# Altium schematic sheet 1_Sheet_1.schdoc
size 373 x 218 mm
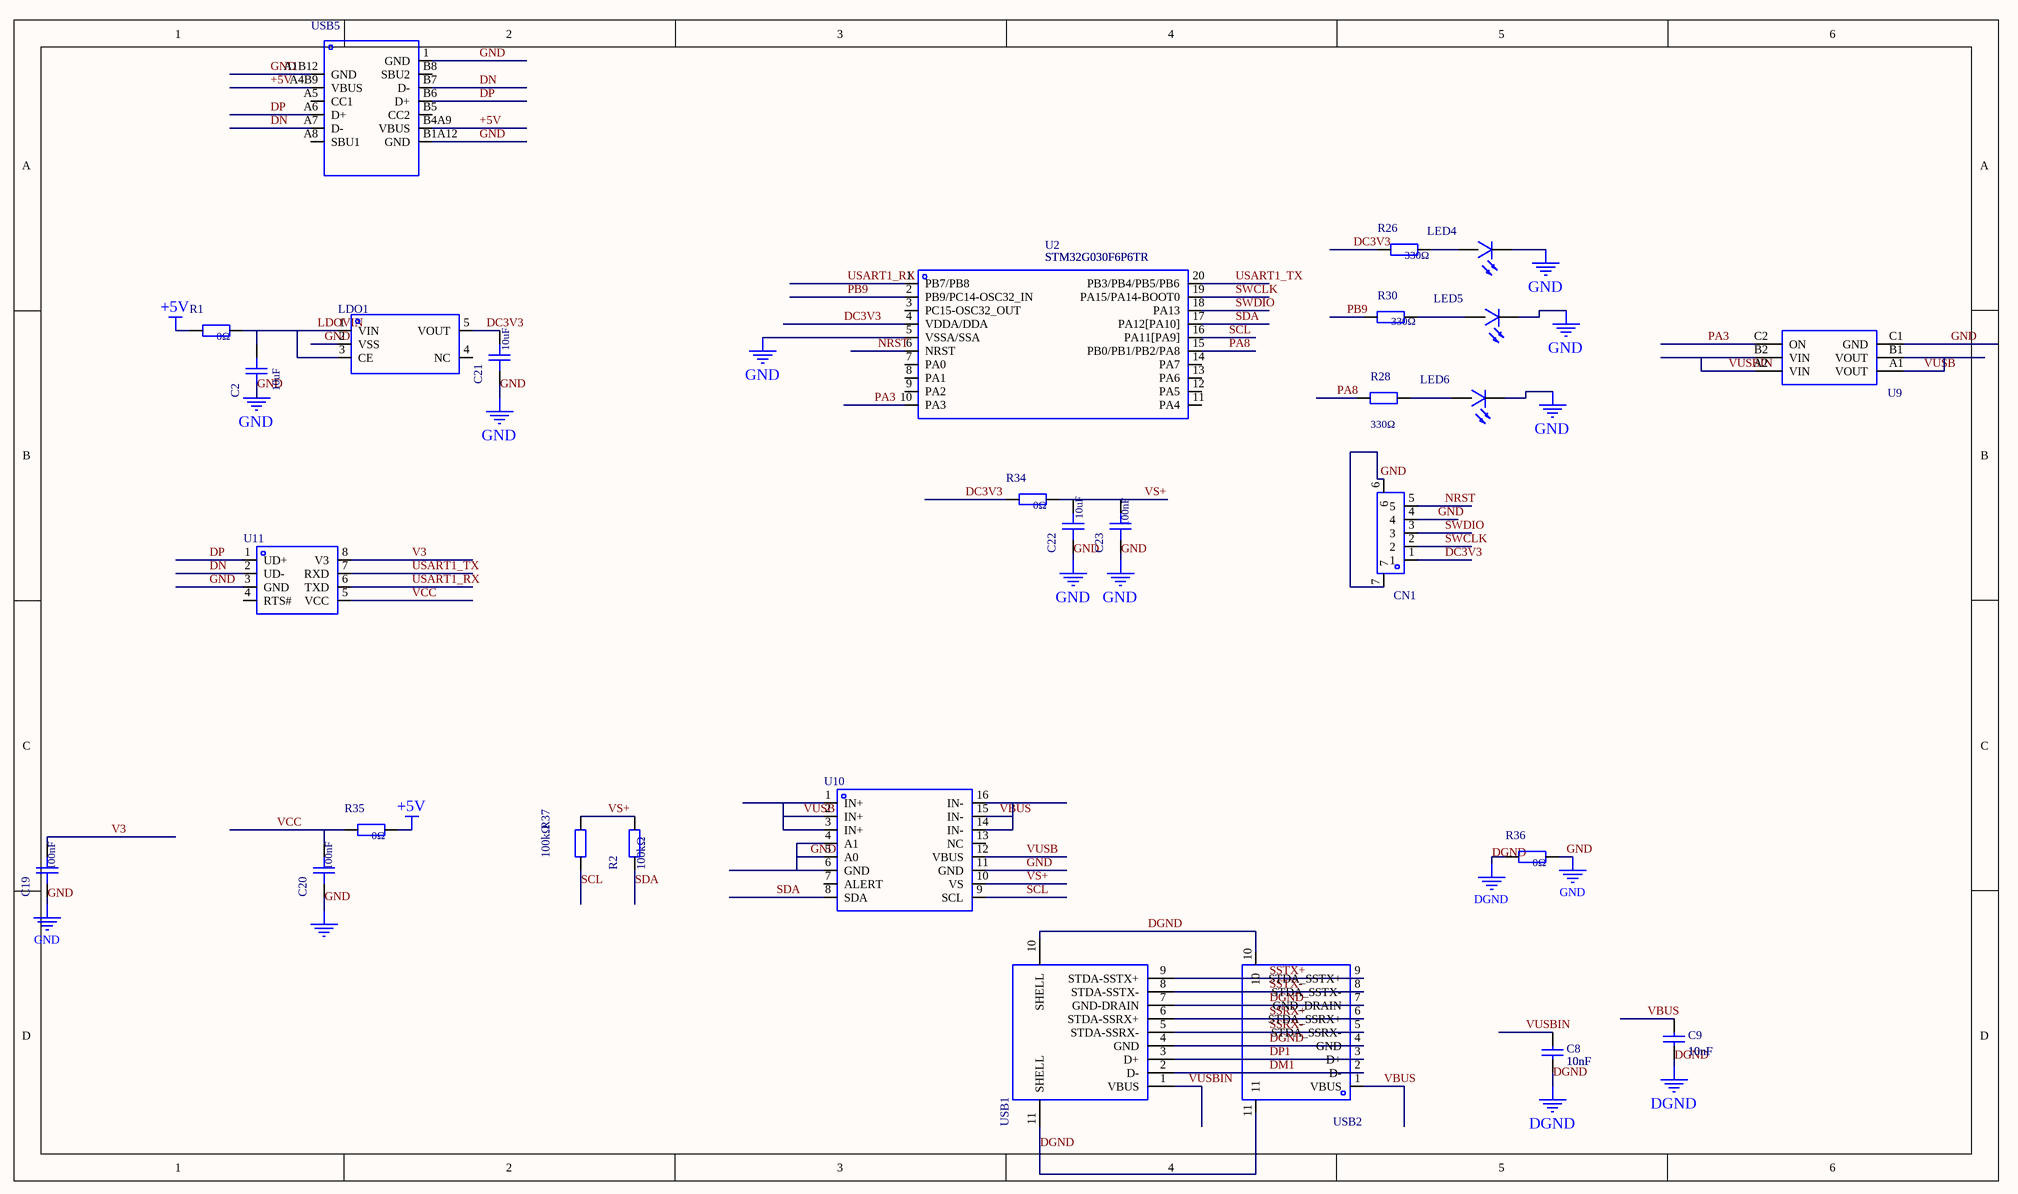
[diagram p0: 1_Sheet_1.schdoc]

## Parts
C2  Capacitance: 10uF  [C0603_1]
C8  10nF  [C0402]
C9  10nF  [C0402]
C19  Capacitance: 100nF  [C0402_1]
C20  Capacitance: 100nF  [C0402_1]
C21  Capacitance: 10uF  [C0603_1]
C22  Capacitance: 10uF  [C0603_1]
C23  Capacitance: 100nF  [C0402_1]
CN1  (no value)  [CONN-SMD_2.54-5P-LT]
LDO1  (no value)  [SOT-23-5_L3.0-W1.7-P0.95-LS2.8-BR]
LED4  (no value)  [LED0402-RD]
LED5  (no value)  [LED0402-RD]
LED6  (no value)  [LED0402-RD]
R1  Resistance: 0Ω  [R0402]
R2  value 100kΩ  [R0402]
R26  Resistance: 330Ω  [R0402]
R28  Resistance: 330Ω  [R0402]
R30  Resistance: 330Ω  [R0402]
R34  Resistance: 0Ω  [R0402]
R35  Resistance: 0Ω  [R0402]
R36  Resistance: 0Ω  [R0402]
R37  value 100kΩ  [R0402]
U2  STM32G030F6P6TR  [TSSOP-20_L6.5-W4.4-P0.65-LS6.4-BL]
U9  (no value)  [DSBGA-6_L1.5-W1.0-P0.50-TL]
U10  (no value)  [TSSOP-16_L5.0-W4.4-P0.65-LS6.4-BL]
U11  (no value)  [SOP-8_L5.0-W4.0-P1.27-LS6.0-BL]
USB1  (no value)  [USB-3.0-SMD_CU3M002_USBA-M]
USB2  (no value)  [USB-A-SMD_U231-091N-4BLRA00-S-1]
USB5  (no value)  [USB-C-SMD_TYPE-C-31-M-09]

## Nets
+5V: R1.1 R35.2 USB5.A4B9(VBUS) USB5.B4A9(VBUS)
DGND: C8.1 C9.1 R36.1 USB1.4(GND) USB1.7(GND-DRAIN) USB1.10(SHELL) USB1.11(SHELL) USB2.4(GND) USB2.7(GND_DRAIN) USB2.10 USB2.11
GND: C2.1 C19.1 C20.1 C21.1 C22.1 C23.1 CN1.4 CN1.6 CN1.7 LDO1.2(VSS) LED4.1(-) LED5.1(-) LED6.1(-) R36.2 U2.5(VSSA/SSA) U9.C1(GND) U10.4(A1) U10.5(A0) U10.6(GND) U10.11(GND) U11.3(GND) USB5.1(GND) USB5.A1B12(GND) USB5.B1A12(GND)
DC3V3: C21.2 CN1.1 LDO1.5(VOUT) R26.1 R34.1 U2.4(VDDA/DDA)
DM1: USB1.2(D-) USB2.2(D-)
DN: U11.2(UD-) USB5.A7(D-) USB5.B7(D-)
DP: U11.1(UD+) USB5.A6(D+) USB5.B6(D+)
DP1: USB1.3(D+) USB2.3(D+)
LDOVIN: C2.2 LDO1.1(VIN) LDO1.3(CE) R1.2
NRST: CN1.5 U2.6(NRST)
PA3: U2.10(PA3) U9.C2(ON)
PA8: R28.1 U2.15(PB0/PB1/PB2/PA8)
PB9: R30.1 U2.2(PB9/PC14-OSC32_IN)
SCL: R37.1 U2.16(PA11[PA9]) U10.9(SCL)
SDA: R2.1 U2.17(PA12[PA10]) U10.8(SDA)
SSRX+: USB1.6(STDA-SSRX+) USB2.6(STDA_SSRX+)
SSRX-: USB1.5(STDA-SSRX-) USB2.5(STDA_SSRX-)
SSTX+: USB1.9(STDA-SSTX+) USB2.9(STDA_SSTX+)
SSTX-: USB1.8(STDA-SSTX-) USB2.8(STDA_SSTX-)
SWCLK: CN1.2 U2.19(PA15/PA14-BOOT0)
SWDIO: CN1.3 U2.18(PA13)
USART1_RX: U2.1(PB7/PB8) U11.6(TXD)
USART1_TX: U2.20(PB3/PB4/PB5/PB6) U11.7(RXD)
V3: C19.2 U11.8(V3)
VBUS: C9.2 U10.14(IN-) U10.15(IN-) U10.16(IN-) USB2.1(VBUS)
VCC: C20.2 R35.1 U11.5(VCC)
VS+: C22.2 C23.2 R2.2 R34.2 R37.2 U10.10(VS)
VUSB: U9.A1(VOUT) U9.B1(VOUT) U10.1(IN+) U10.2(IN+) U10.3(IN+) U10.12(VBUS)
VUSBIN: C8.2 U9.A2(VIN) U9.B2(VIN) USB1.1(VBUS)
NetLED4_2: LED4.2(+) R26.2
NetLED5_2: LED5.2(+) R30.2
NetLED6_2: LED6.2(+) R28.2

Not connected (* = marked no-connect by the designer): LDO1 4(NC); U2 3(PC15-OSC32_OUT) 7(PA0) 8(PA1) 9(PA2) 11(PA4) 12(PA5) 13(PA6) 14(PA7); U10 7(ALERT) 13(NC); U11 4(RTS#); USB5 A5(CC1) A8(SBU1) B5(CC2) B8(SBU2)

## Library data of the parts
C2 C21 C22 = CL10A106MA8NRNC: Manufacturer: SAMSUNG(三星); Add into BOM: yes; Temperature Coefficient: X5R; Voltage Rated: 25V; Tolerance: ±20%; Description: 温度系数:X5R;额定电压:25V;精度:±20%;精度:±20%;容值:10uF;; Symbol: CL10A106MA8NRNC; Device: CL10A106MA8NRNC; Supplier Part: C96446; Manufacturer Part: CL10A106MA8NRNC; LCSC On Sale: 1; Supplier Footprint: 0603; JLCPCB Part Class: Extended Part; JLCPCB On Sale: 1; Datasheet: https://atta.szlcsc.com/upload/public/pdf/source/20170325/1490427913016.pdf; Supplier: LCSC; Convert to PCB: yes; JLCPCB Stock: 20411
C8 C9 = CL05B103KB5NNNC: Manufacturer: SAMSUNG; Convert to PCB: yes; Symbol: CL05B103KB5NNNC; Name: 10nF; Device: CL05B103KB5NNNC; Supplier: LCSC; Manufacturer Part: CL05B103KB5NNNC; Supplier Part: C15195; JLCPCB Part Class: Basic Part; Add into BOM: yes; Origin Footprint: C0402
C19 C20 C23 = CC0402KRX7R7BB104: Manufacturer: YAGEO(国巨); Add into BOM: yes; Temperature Coefficient: X7R; Tolerance: ±10%; Voltage Rated: 16V; Description: 温度系数:X7R;容值:100nF;精度:±10%;精度:±10%;额定电压:16V;; Symbol: CC0402KRX7R7BB104; Device: CC0402KRX7R7BB104; Supplier Part: C60474; Manufacturer Part: CC0402KRX7R7BB104; LCSC On Sale: 1; Supplier Footprint: 0402; Price: 0.006593; JLCPCB Part Class: Extended Part; JLCPCB Stock: 54369200; JLCPCB On Sale: 1; Datasheet: https://atta.szlcsc.com/upload/public/pdf/source/20170518/1495086054592.pdf; Supplier: LCSC; Convert to PCB: yes
CN1 = 2.54-5P LT: Manufacturer: SHOU HAN(首韩); Add into BOM: yes; Symbol: 2.54-5P LT; Device: 2.54-5P LT; LCSC Part Name: 2.5/2.54立贴针座 2.5mm间距5P立式贴片 加盖; Supplier Part: C2681545; Manufacturer Part: 2.54-5P LT; LCSC Stock: 0; LCSC On Sale: 1; Supplier Footprint: P=2.54mm; Price: 0.463; JLCPCB Part Class: Extended Part; JLCPCB Stock: 0; Datasheet: https://atta.szlcsc.com/upload/public/pdf/source/20210107/C2681545_C69CDB1EFB27475B41E0A52C2B709434.pdf; Supplier: LCSC; Convert to PCB: yes
LDO1 = ME6211C33M5G-N: Manufacturer: MICRONE(南京微盟); Add into BOM: yes; Voltage - Input (Max): 6V; Current - Supply (Max): 60μA; Voltage Dropout (Max): 260mV @ 200mA(typ); Output Current (Max): 500mA; Output Configuration: 正; Ripple Rejection (PSRR): 70dB ~ 62dB(1kHz ~ 10kHz); Output Type: 固定; Number of Output Channels: 1; Voltage - Output (Fixed): 3.3V; Description: 最大输入电压:6V;压降(max):260mV @ 200mA(typ);输出电压(可调):-;静态电流(Iq):-;输出类型:固定;输出电压(固定):3.3V;; Symbol: ME6211C33M5G-N; Device: ME6211C33M5G-N; LCSC Part Name: ME6211C33M5G-N; Supplier Part: C82942; Manufacturer Part: ME6211C33M5G-N; LCSC Stock: 0; LCSC On Sale: 1; Supplier Footprint: SOT-23-5; Price: 0.408; JLCPCB Part Class: Extended Part; JLCPCB Stock: 990; JLCPCB On Sale: 1; Datasheet: https://atta.szlcsc.com/upload/public/pdf/source/20170918/C82942_1505727073070976520.pdf; Supplier: LCSC; Convert to PCB: yes; Voltage - Output (adj): -; Quiescent Current (Iq): -; Operating Temperature: -40℃~150℃; Enabling feet: -
LED4-LED6 = 16-213/SDRC/S530-A3/TR8: Manufacturer: EVERLIGHT(台湾亿光); Add into BOM: yes; Illumination Color: 红色; Description: 照明颜色:红色;; Symbol: 16-213/SDRC/S530-A3/TR8; Device: 16-213/SDRC/S530-A3/TR8; Supplier Part: C71911; Manufacturer Part: 16-213/SDRC/S530-A3/TR8; LCSC On Sale: 1; Supplier Footprint: 0402; JLCPCB Part Class: Extended Part; JLCPCB On Sale: 1; Datasheet: https://atta.szlcsc.com/upload/public/pdf/source/20180423/C71911_C51F85E8EEDEC443F292EE02E8E26750.pdf; Supplier: LCSC; Convert to PCB: yes; Mounting Type: Top View; JLCPCB Stock: 25811
R1 R34-R36 = RC0402FR-070RL: Manufacturer: YAGEO(国巨); Add into BOM: yes; Power(Watts): 1/16W; Tolerance: ±1%; Description: 温度系数:-;温度系数:-;功率:1/16W;精度:±1%;阻值:0Ω;; Symbol: RC0402FR-070RL; Device: RC0402FR-070RL; Supplier Part: C106231; Manufacturer Part: RC0402FR-070RL; LCSC On Sale: 1; Supplier Footprint: 0402; JLCPCB Part Class: Extended Part; JLCPCB On Sale: 1; Datasheet: https://atta.szlcsc.com/upload/public/pdf/source/20170518/1495085712260.pdf; Supplier: LCSC; Convert to PCB: yes; Temperature Coefficient: -; JLCPCB Stock: 2089500
R2 R37 = RC-02W104JT: Manufacturer: FH(风华); Add into BOM: yes; Tolerance: ±5%; Temperature Coefficient: ±200ppm/℃; Power(Watts): 1/16W; Overload Voltage (Max): 50V; Description: 精度:±5%;温度系数:±200ppm/℃;阻值:100kΩ;功率:1/16W;最大工作电压:50V;工作温度范围:-55℃~+155℃;; Symbol: RC-02W104JT; Device: RC-02W104JT; LCSC Part Name: 100KΩ(104) ±5%; Supplier Part: C280907; Manufacturer Part: RC-02W104JT; LCSC Stock: 63615; LCSC On Sale: 1; Supplier Footprint: 0402; Price: 0.003; JLCPCB Part Class: Extended Part; JLCPCB Stock: 0; Datasheet: https://atta.szlcsc.com/upload/public/pdf/source/20180906/C280907_D9C8CEA768E2CBC6A5B6D2C56296FBDB.pdf; Supplier: LCSC; Convert to PCB: yes; Operating Temperature Range: -55℃~+155℃
R26 R28 R30 = 0402WGF3300TCE: Manufacturer: UNI-ROYAL(厚声); Add into BOM: yes; Tolerance: ±1%; Power(Watts): 1/16W; Temperature Coefficient: ±100ppm/℃; Description: 阻值:330Ω;精度:±1%;功率:1/16W;温度系数:±100ppm/℃;温度系数:±100ppm/℃;; Symbol: 0402WGF3300TCE; Device: 0402WGF3300TCE; Supplier Part: C25104; Manufacturer Part: 0402WGF3300TCE; LCSC On Sale: 1; Supplier Footprint: 0402; JLCPCB Part Class: Basic Part; JLCPCB On Sale: 1; Datasheet: https://atta.szlcsc.com/upload/public/pdf/source/20170920/C25104_1505901212369982735.pdf; Supplier: LCSC; Convert to PCB: yes; JLCPCB Stock: 26687
U2 = STM32G030F6P6TR: Manufacturer: STMicroelectronics; Convert to PCB: yes; Symbol: STM32G030F6P6TR; Name: STM32G030F6P6TR; Device: STM32G030F6P6TR; Supplier: LCSC; Supplier Part: C529330; Manufacturer Part: STM32G030F6P6TR; JLCPCB Part Class: Extended Part; Add into BOM: yes; Origin Footprint: TSSOP-20_L6.5-W4.4-P0.65-LS6.4-BL
U9 = TPS22964CYZPR: Manufacturer: TI(德州仪器); Add into BOM: yes; Description: TPS22964C 具有控制启动和快速输出放电的小型、超低导通电阻负载开关; Symbol: TPS22964CYZPR; Device: TPS22964CYZPR; LCSC Part Name: TPS22964CYZPR; Supplier Part: C431579; Manufacturer Part: TPS22964CYZPR; LCSC Stock: 0; LCSC On Sale: 1; Supplier Footprint: DSBGA-6; Price: 7.59; JLCPCB Part Class: Extended Part; JLCPCB Stock: 0; Datasheet: https://atta.szlcsc.com/upload/public/pdf/source/20190926/C431579_E2E7F4F213A2633EE95623F3A3289932.pdf; Supplier: LCSC; Convert to PCB: yes
U10 = INA260AIPW: Manufacturer: TI(德州仪器); Add into BOM: yes; Monitor Type: Low/High Side; Amplifier Type: Current Sense; Common-mode Input Voltage: 0V~36V; Voltage - Supply: 2.7V~5.5V; Description: INA260 具有集成 2mΩ 并联电阻的高/低侧数字电流/功率监视器; Symbol: INA260AIPW; Device: INA260AIPW; LCSC Part Name: INA260AIPW; Supplier Part: C181331; Manufacturer Part: INA260AIPW; LCSC Stock: 0; LCSC On Sale: 1; Supplier Footprint: TSSOP-16; Price: 44.64; JLCPCB Part Class: Extended Part; JLCPCB Stock: 0; JLCPCB On Sale: 1; Datasheet: https://atta.szlcsc.com/upload/public/pdf/source/20180227/C181331_15196974334051369950.pdf; Supplier: LCSC; Convert to PCB: yes; Features: 低侧或高侧,双向,低漂移,高精度
U11 = CH340N: Manufacturer: WCH(南京沁恒); Add into BOM: yes; Symbol: CH340N; Device: CH340N; LCSC Part Name: CH340N; Supplier Part: C506813; Manufacturer Part: CH340N; LCSC Stock: 188; LCSC On Sale: 1; Supplier Footprint: SOP-8; Price: 3.07; JLCPCB Part Class: Extended Part; JLCPCB Stock: 0; JLCPCB On Sale: 1; Datasheet: https://atta.szlcsc.com/upload/public/pdf/source/20200819/C84681_ADBED554CE321879DBD6B1D06488689C.pdf; Supplier: LCSC; Convert to PCB: yes
USB1 = 917-P81A205CS60202: Manufacturer: 精拓金; Symbol: CU3M002_USB A/M 3.0 SMT L=1.9 K; Add into BOM: yes; Number of Ports: 1; Mounting Angle: 水平; Current Rating: 0.25A; Gender: 公头; Connector Type: USB - Type A; Number of Contacts: 9; Description: 公母:公头;连接器类型:USB - Type A;触点数量:9;标准:USB 3.0;; Device: 917-P81A205CS60202; LCSC Part Name: AM/3.0沉板弯脚有孔铁壳L=1.9MM LCP蓝胶SMT有柱; Supplier Part: C68740; Manufacturer Part: 917-P81A205CS60202; LCSC Stock: 1478; LCSC On Sale: 1; Supplier Footprint: SMD; Price: 1.004; JLCPCB Part Class: Extended Part; JLCPCB Stock: 95; JLCPCB On Sale: 1; Datasheet: https://atta.szlcsc.com/upload/public/pdf/source/20210308/C68740_5390C8281B948707911F0B344B222304.pdf; Supplier: LCSC; Convert to PCB: yes; Standard: USB 3.0
USB2 = U231-091N-4BLRA00-S-1: Manufacturer: XKB Connectivity(中国星坤); Add into BOM: yes; Description: 公母:母座;连接器类型:USB - Type A;触点数量:5;标准:USB 3.1;; Symbol: U231-091N-4BLRA00-S-1; Device: U231-091N-4BLRA00-S-1; LCSC Part Name: USB3.0  SPCC; Supplier Part: C381140; Manufacturer Part: U231-091N-4BLRA00-S-1; LCSC Stock: 14619; LCSC On Sale: 1; Supplier Footprint: SMD; Price: 0.923; JLCPCB Part Class: Extended Part; JLCPCB Stock: 5391; JLCPCB On Sale: 1; Datasheet: https://atta.szlcsc.com/upload/public/pdf/source/20200227/C381140_20791354F8C664AD4682A2E3B105EB66.pdf; Supplier: LCSC; Convert to PCB: yes
USB5 = TYPE-C-31-M-09: Manufacturer: 韩国韩荣; Add into BOM: yes; Description: 连接器类型:-;公母:-;触点数量:-;标准:-;; Symbol: TYPE-C-31-M-09; Device: TYPE-C-31-M-09; LCSC Part Name: TYPE-C USB; Supplier Part: C2689967; Manufacturer Part: TYPE-C-31-M-09; LCSC Stock: 1182; LCSC On Sale: 1; Supplier Footprint: SMD; Price: 2.37; JLCPCB Part Class: Extended Part; JLCPCB Stock: 892; JLCPCB On Sale: 1; Datasheet: https://atta.szlcsc.com/upload/public/pdf/source/20210810/4FB1FF27D732B53405BB8B0F3A718A10.pdf; Supplier: LCSC; Convert to PCB: yes; Connector Type: -; Mounting Angle: -; Current Rating: -; Gender: -; Number of Contacts: -; Number of Ports: -; Mounting Type: -; Standard: -